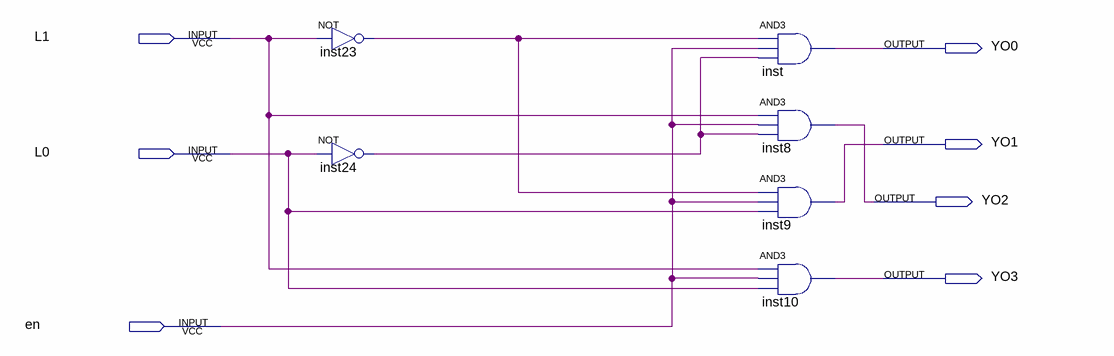
[diagram p0: schematic sheet]
// Quartus schematic My_24.bdf as structural Verilog: 6 symbols, 7 pins
module My_24 (
  input  L1,
  input  L0,
  input  en,
  output YO0,
  output YO1,
  output YO2,
  output YO3
);

  wire inst23_out, inst24_out;

  not inst23 (inst23_out, L1);
  not inst24 (inst24_out, L0);
  and inst (YO0, inst23_out, en, inst24_out);
  and inst8 (YO2, L1, en, inst24_out);
  and inst9 (YO1, inst23_out, en, L0);
  and inst10 (YO3, L1, en, L0);
endmodule
